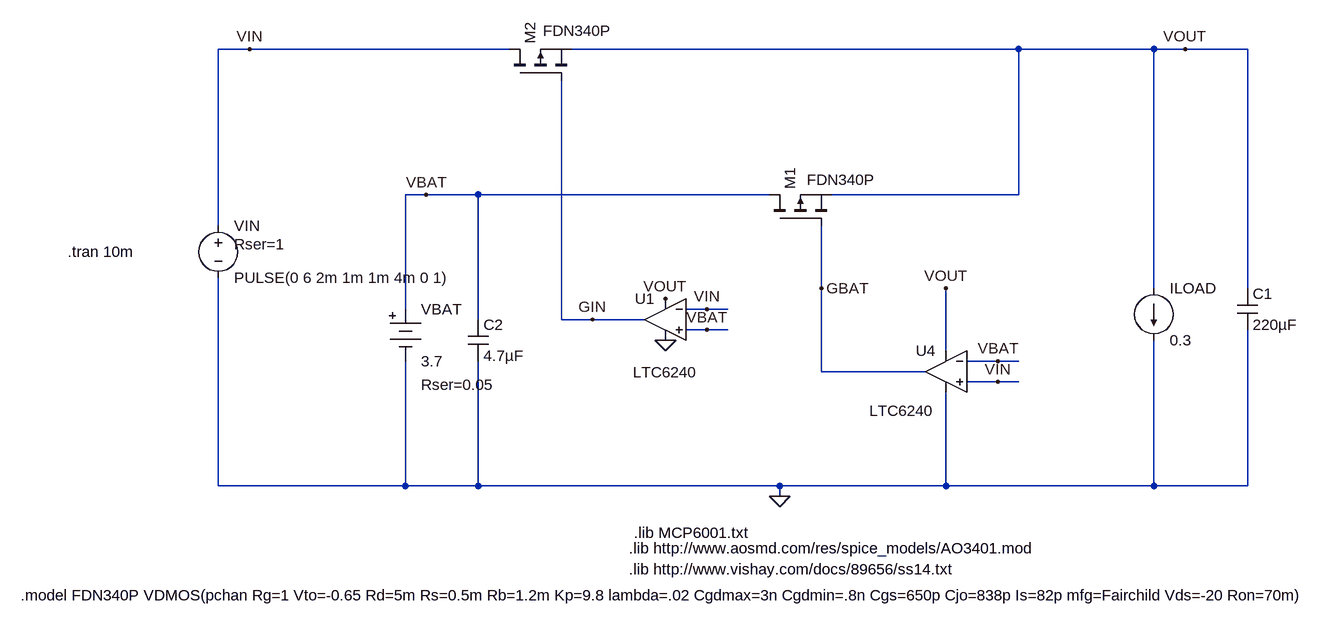
[diagram p0: schematic FETIdealDiode.asc]
FETIdealDiode.asc, the LTspice schematic file:
Version 4
SHEET 1 2320 680
WIRE -592 -384 -640 -384
WIRE -192 -384 -592 -384
WIRE 592 -384 -96 -384
WIRE 800 -384 592 -384
WIRE 848 -384 800 -384
WIRE 944 -384 848 -384
WIRE -320 -160 -352 -160
WIRE -240 -160 -320 -160
WIRE 208 -160 -240 -160
WIRE 592 -160 592 -384
WIRE 592 -160 304 -160
WIRE -640 -112 -640 -384
WIRE 288 -16 288 -112
WIRE 800 -16 800 -384
WIRE 944 -16 944 -384
WIRE -352 16 -352 -160
WIRE 112 16 80 16
WIRE 144 16 112 16
WIRE -240 32 -240 -160
WIRE -112 32 -112 -336
WIRE -64 32 -112 32
WIRE 16 32 -64 32
WIRE 112 48 80 48
WIRE 144 48 112 48
WIRE 480 80 480 -16
WIRE 560 96 512 96
WIRE 592 96 560 96
WIRE 288 112 288 -16
WIRE 448 112 288 112
WIRE 560 128 512 128
WIRE 592 128 560 128
WIRE -640 288 -640 -32
WIRE -352 288 -352 96
WIRE -352 288 -640 288
WIRE -240 288 -240 96
WIRE -240 288 -352 288
WIRE 224 288 -240 288
WIRE 480 288 480 144
WIRE 480 288 224 288
WIRE 800 288 800 64
WIRE 800 288 480 288
WIRE 944 288 944 48
WIRE 944 288 800 288
WIRE 224 304 224 288
FLAG 224 304 0
FLAG -592 -384 VIN
FLAG -320 -160 VBAT
FLAG 848 -384 VOUT
FLAG 480 -16 VOUT
FLAG 560 128 VIN
FLAG 288 -16 GBAT
FLAG 560 96 VBAT
FLAG 48 0 VOUT
FLAG 48 64 0
FLAG -64 32 GIN
FLAG 112 48 VBAT
FLAG 112 16 VIN
SYMBOL voltage -640 -128 R0
WINDOW 123 0 0 Left 2
WINDOW 39 24 44 Left 2
SYMATTR SpiceLine Rser=1
SYMATTR InstName VIN
SYMATTR Value PULSE(0 6 2m 1m 1m 4m 0 1)
SYMBOL pmos 208 -112 R270
WINDOW 3 71 58 VRight 2
SYMATTR Value FDN340P
SYMATTR InstName M1
SYMATTR Prefix M
SYMBOL pmos -192 -336 R270
WINDOW 3 76 52 VRight 2
SYMATTR Value FDN340P
SYMATTR InstName M2
SYMATTR Prefix M
SYMBOL Misc\\battery -352 0 R0
WINDOW 123 0 0 Left 2
WINDOW 39 24 132 Left 2
SYMATTR SpiceLine Rser=0.05
SYMATTR InstName VBAT
SYMATTR Value 3.7
SYMBOL current 800 -16 R0
WINDOW 123 0 0 Left 2
WINDOW 39 0 0 Left 2
SYMATTR InstName ILOAD
SYMATTR Value 0.3
SYMBOL cap 928 -16 R0
SYMATTR InstName C1
SYMATTR Value 220µF
SYMATTR SpiceLine Rser=65m
SYMBOL Opamps\\LTC6240 480 112 M0
WINDOW 3 18 60 Left 2
SYMATTR InstName U4
SYMBOL Opamps\\LTC6240 48 32 M0
WINDOW 3 -50 81 Left 2
SYMATTR InstName U1
SYMBOL cap -256 32 R0
SYMATTR InstName C2
SYMATTR Value 4.7µF
SYMATTR SpiceLine Rser=65m
TEXT -872 -72 Left 2 !.tran 10m
TEXT -8 384 Left 2 !.lib http://www.aosmd.com/res/spice_models/AO3401.mod
TEXT -8 416 Left 2 !.lib http://www.vishay.com/docs/89656/ss14.txt
TEXT -944 456 Left 2 !.model FDN340P VDMOS(pchan Rg=1 Vto=-0.65 Rd=5m Rs=0.5m Rb=1.2m Kp=9.8 lambda=.02 Cgdmax=3n Cgdmin=.8n Cgs=650p Cjo=838p Is=82p mfg=Fairchild Vds=-20 Ron=70m)
TEXT 0 360 Left 2 !.lib MCP6001.txt

The netlist it stands for:
* FETIdealDiode.asc
VIN VIN 0 PULSE(0 6 2m 1m 1m 4m 0 1) Rser=1
M1 VBAT GBAT VOUT VOUT FDN340P
M2 VIN GIN VOUT VOUT FDN340P
VBAT VBAT 0 3.7 Rser=0.05
ILOAD VOUT 0 0.3
C1 VOUT 0 220µF Rser=65m
* U4: LTC6240 (symbol Opamps\LTC6240 not available, pins judged from their places): In+=VIN In-=VBAT V+=VOUT V-=0 OUT=GBAT
* U1: LTC6240 (symbol Opamps\LTC6240 not available, pins judged from their places): In+=VBAT In-=VIN V+=VOUT V-=0 OUT=GIN
C2 VBAT 0 4.7µF Rser=65m
.model NMOS NMOS
.model PMOS PMOS
.lib standard.mos
.tran 10m
.lib http://www.aosmd.com/res/spice_models/AO3401.mod
.lib http://www.vishay.com/docs/89656/ss14.txt
.model FDN340P VDMOS(pchan Rg=1 Vto=-0.65 Rd=5m Rs=0.5m Rb=1.2m Kp=9.8 lambda=.02 Cgdmax=3n Cgdmin=.8n Cgs=650p Cjo=838p Is=82p mfg=Fairchild Vds=-20 Ron=70m)
.lib MCP6001.txt
.backanno
.end